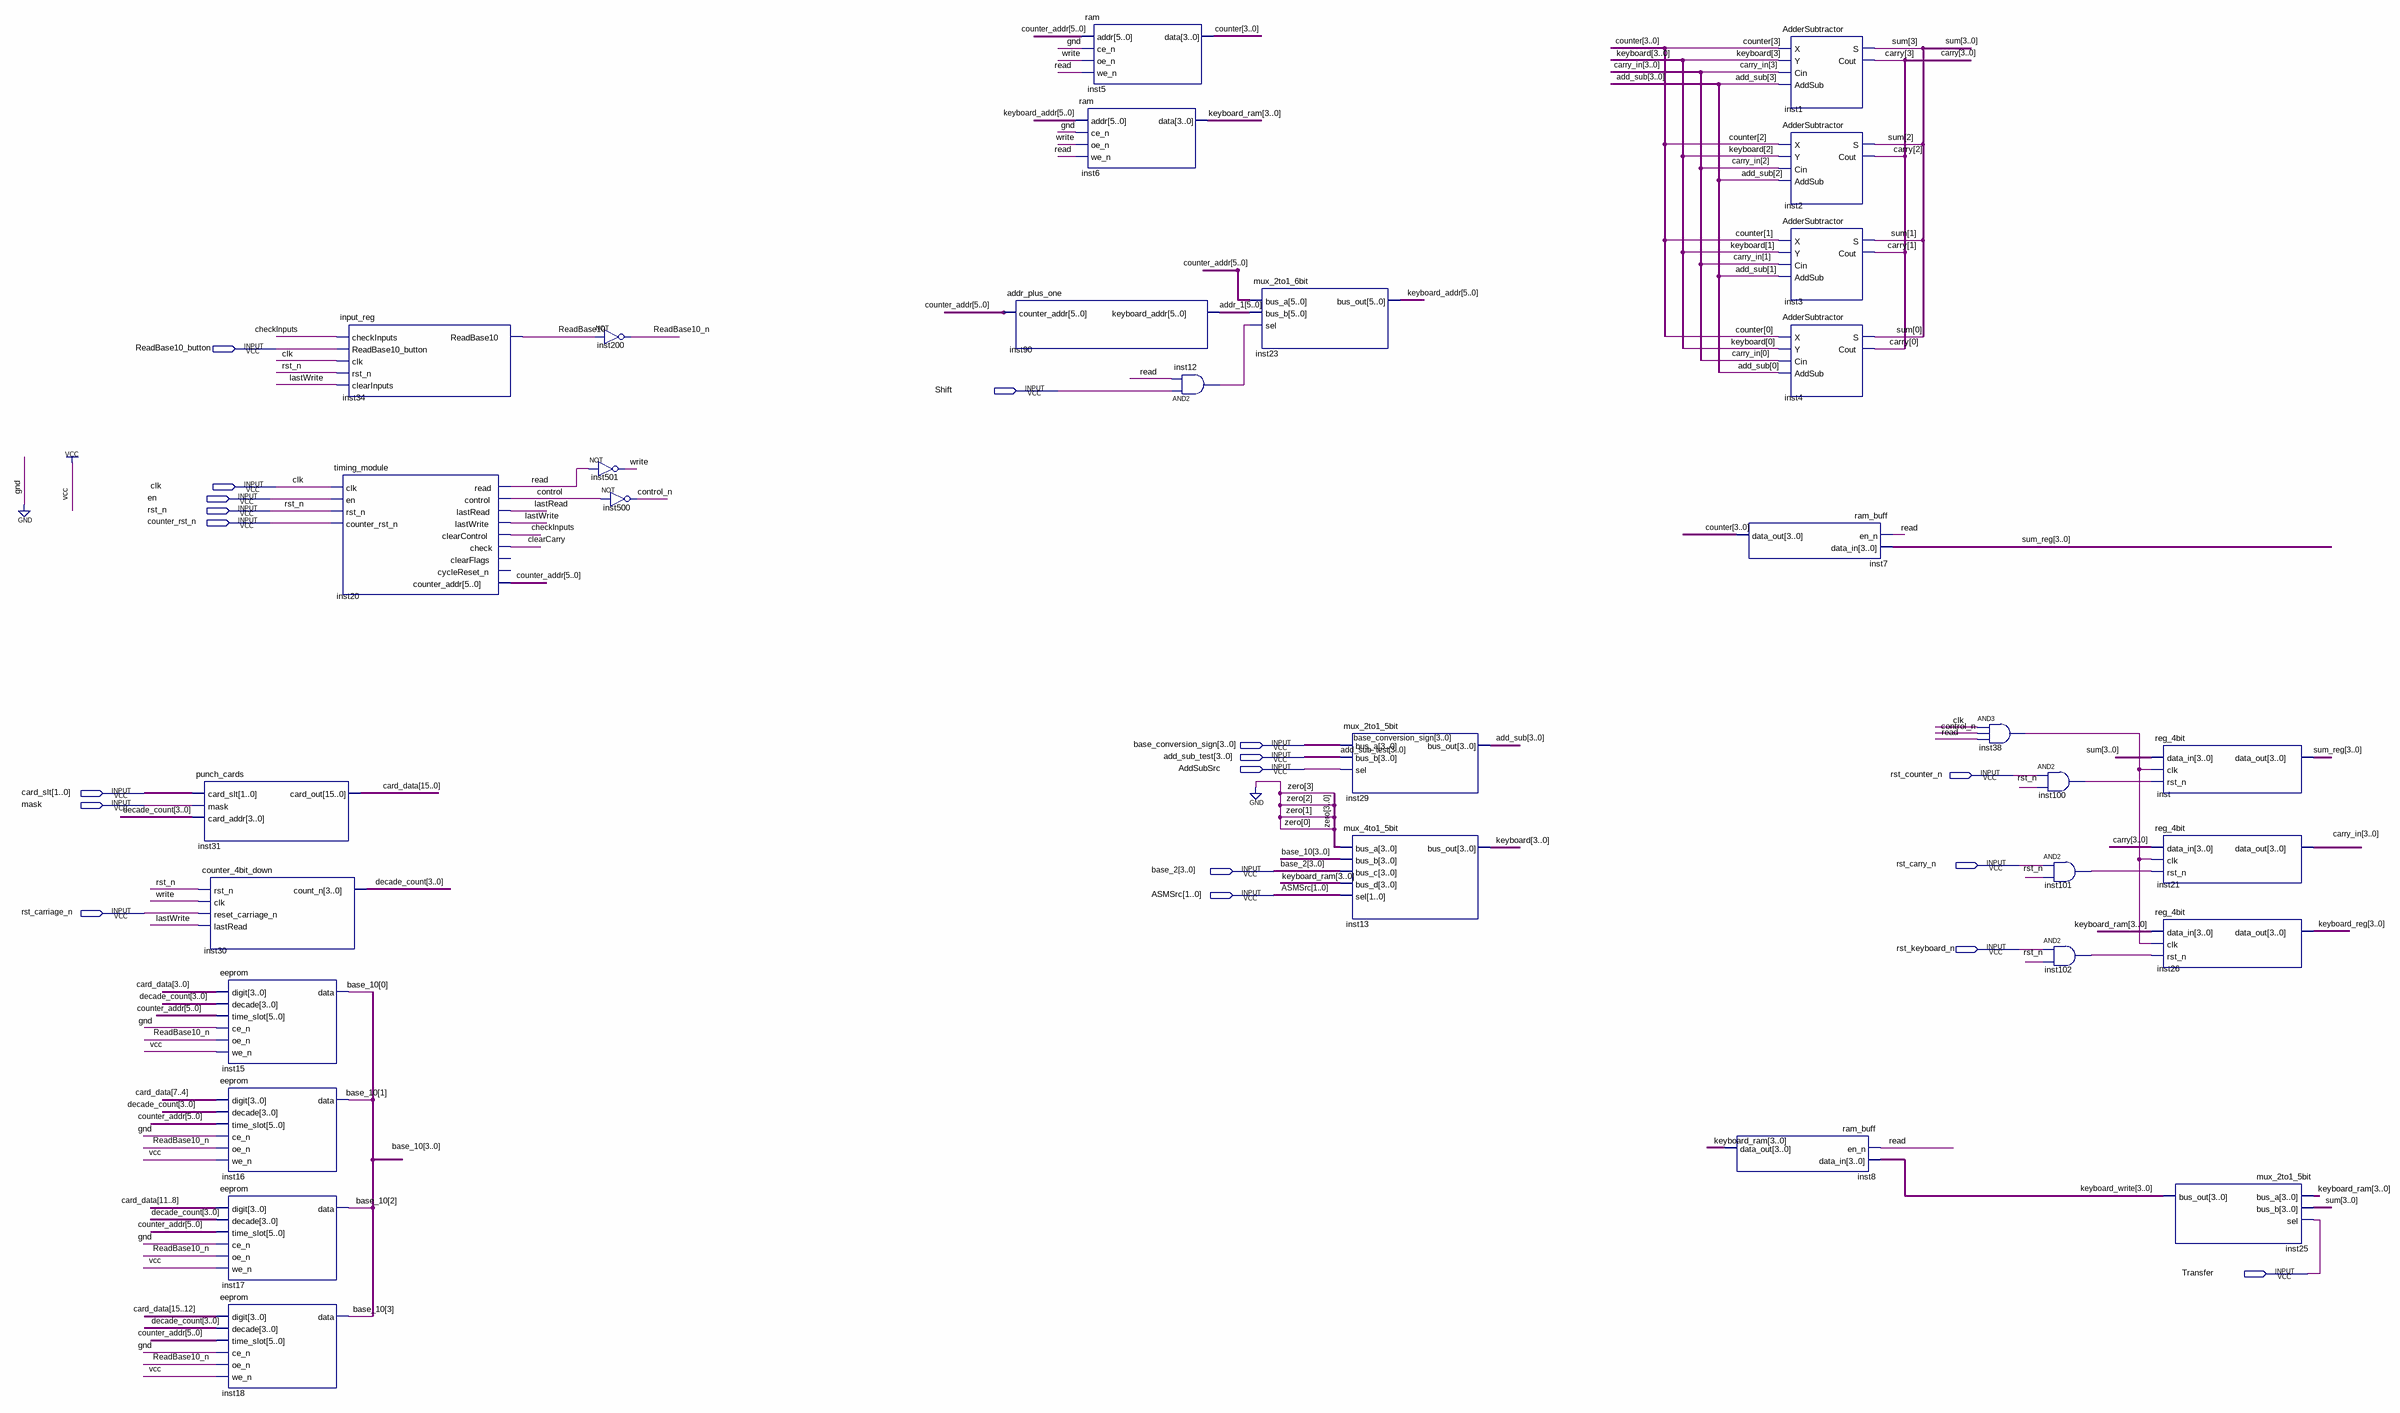
[diagram p0: schematic sheet]
// Quartus schematic main.bdf as structural Verilog: 32 symbols, 18 pins
module main (
  input  ReadBase10_button,
  input  Shift,
  input  clk,
  input  en,
  input  rst_n,
  input  counter_rst_n,
  input  [3:0] base_conversion_sign,
  input  [3:0] add_sub_test,
  input  AddSubSrc,
  input  rst_counter_n,
  input  [1:0] card_slt,
  input  mask,
  input  rst_carry_n,
  input  [3:0] base_2,
  input  [1:0] ASMSrc,
  input  rst_carriage_n,
  input  rst_keyboard_n,
  input  Transfer
);

  wire checkInputs, clearCarry, control, control_n, inst12_out, inst38_out, inst100_out, inst101_out,
       inst102_out, lastRead, lastWrite, read, ReadBase10, ReadBase10_n, write;
  wire [3:0] add_sub, base_10, carry, carry_in, counter, decade_count, keyboard, keyboard_ram, keyboard_reg,
       keyboard_write, sum, sum_reg;
  wire [5:0] addr_1, counter_addr, keyboard_addr;
  wire [15:0] card_data;

  punch_cards inst31 (.card_slt(card_slt), .mask(mask), .card_addr(decade_count), .card_out(card_data));
  counter_4bit_down inst30 (
    .rst_n(rst_n), .clk(write), .reset_carriage_n(rst_carriage_n), .lastRead(lastWrite),
    .count_n(decade_count));
  eeprom inst15 (
    .digit(card_data[3:0]), .decade(decade_count), .time_slot(counter_addr), .ce_n(1'b0),
    .oe_n(ReadBase10_n), .we_n(1'b1), .data(base_10[0]));
  eeprom inst16 (
    .digit(card_data[7:4]), .decade(decade_count), .time_slot(counter_addr), .ce_n(1'b0),
    .oe_n(ReadBase10_n), .we_n(1'b1), .data(base_10[1]));
  eeprom inst17 (
    .digit(card_data[11:8]), .decade(decade_count), .time_slot(counter_addr), .ce_n(1'b0),
    .oe_n(ReadBase10_n), .we_n(1'b1), .data(base_10[2]));
  eeprom inst18 (
    .digit(card_data[15:12]), .decade(decade_count), .time_slot(counter_addr), .ce_n(1'b0),
    .oe_n(ReadBase10_n), .we_n(1'b1), .data(base_10[3]));
  input_reg inst34 (
    .checkInputs(checkInputs), .ReadBase10_button(ReadBase10_button), .clk(clk), .rst_n(rst_n),
    .clearInputs(lastWrite), .ReadBase10(ReadBase10));
  timing_module inst20 (
    .clk(clk), .en(en), .rst_n(rst_n), .counter_rst_n(counter_rst_n), .read(read), .control(control),
    .lastRead(lastRead), .lastWrite(lastWrite), .clearControl(checkInputs), .check(clearCarry),
    .counter_addr(counter_addr));  // open: clearFlags, cycleReset_n
  not inst200 (ReadBase10_n, ReadBase10);
  not inst501 (write, read);
  not inst500 (control_n, control);
  addr_plus_one inst90 (.counter_addr(counter_addr), .keyboard_addr(addr_1));
  ram inst6 (.addr(keyboard_addr), .ce_n(1'b0), .oe_n(write), .we_n(read), .data(keyboard_ram));
  ram inst5 (.addr(counter_addr), .ce_n(1'b0), .oe_n(write), .we_n(read), .data(counter));
  and inst12 (inst12_out, Shift, read);
  mux_2to1_6bit inst23 (.bus_a(counter_addr), .bus_b(addr_1), .sel(inst12_out), .bus_out(keyboard_addr));
  mux_2to1_5bit inst29 (.bus_a(base_conversion_sign), .bus_b(add_sub_test), .sel(AddSubSrc), .bus_out(add_sub));
  mux_4to1_5bit inst13 (
    .bus_a(4'b0000), .bus_b(base_10), .bus_c(base_2), .bus_d(keyboard_ram), .sel(ASMSrc), .bus_out(keyboard));
  ram_buff inst7 (.en_n(read), .data_in(sum_reg), .data_out(counter));
  ram_buff inst8 (.en_n(read), .data_in(keyboard_write), .data_out(keyboard_ram));
  AdderSubtractor inst1 (
    .X(counter[3]), .Y(keyboard[3]), .Cin(carry_in[3]), .AddSub(add_sub[3]), .S(sum[3]), .Cout(carry[3]));
  AdderSubtractor inst2 (
    .X(counter[2]), .Y(keyboard[2]), .Cin(carry_in[2]), .AddSub(add_sub[2]), .S(sum[2]), .Cout(carry[2]));
  AdderSubtractor inst3 (
    .X(counter[1]), .Y(keyboard[1]), .Cin(carry_in[1]), .AddSub(add_sub[1]), .S(sum[1]), .Cout(carry[1]));
  AdderSubtractor inst4 (
    .X(counter[0]), .Y(keyboard[0]), .Cin(carry_in[0]), .AddSub(add_sub[0]), .S(sum[0]), .Cout(carry[0]));
  and inst38 (inst38_out, clk, control_n, read);
  and inst100 (inst100_out, rst_counter_n, rst_n);
  and inst101 (inst101_out, rst_carry_n, rst_n);
  and inst102 (inst102_out, rst_keyboard_n, rst_n);
  reg_4bit inst (.data_in(sum), .clk(inst38_out), .rst_n(inst100_out), .data_out(sum_reg));
  reg_4bit inst21 (.data_in(carry), .clk(inst38_out), .rst_n(inst101_out), .data_out(carry_in));
  reg_4bit inst26 (.data_in(keyboard_ram), .clk(inst38_out), .rst_n(inst102_out), .data_out(keyboard_reg));
  mux_2to1_5bit inst25 (.bus_a(keyboard_ram), .bus_b(sum), .sel(Transfer), .bus_out(keyboard_write));
endmodule
